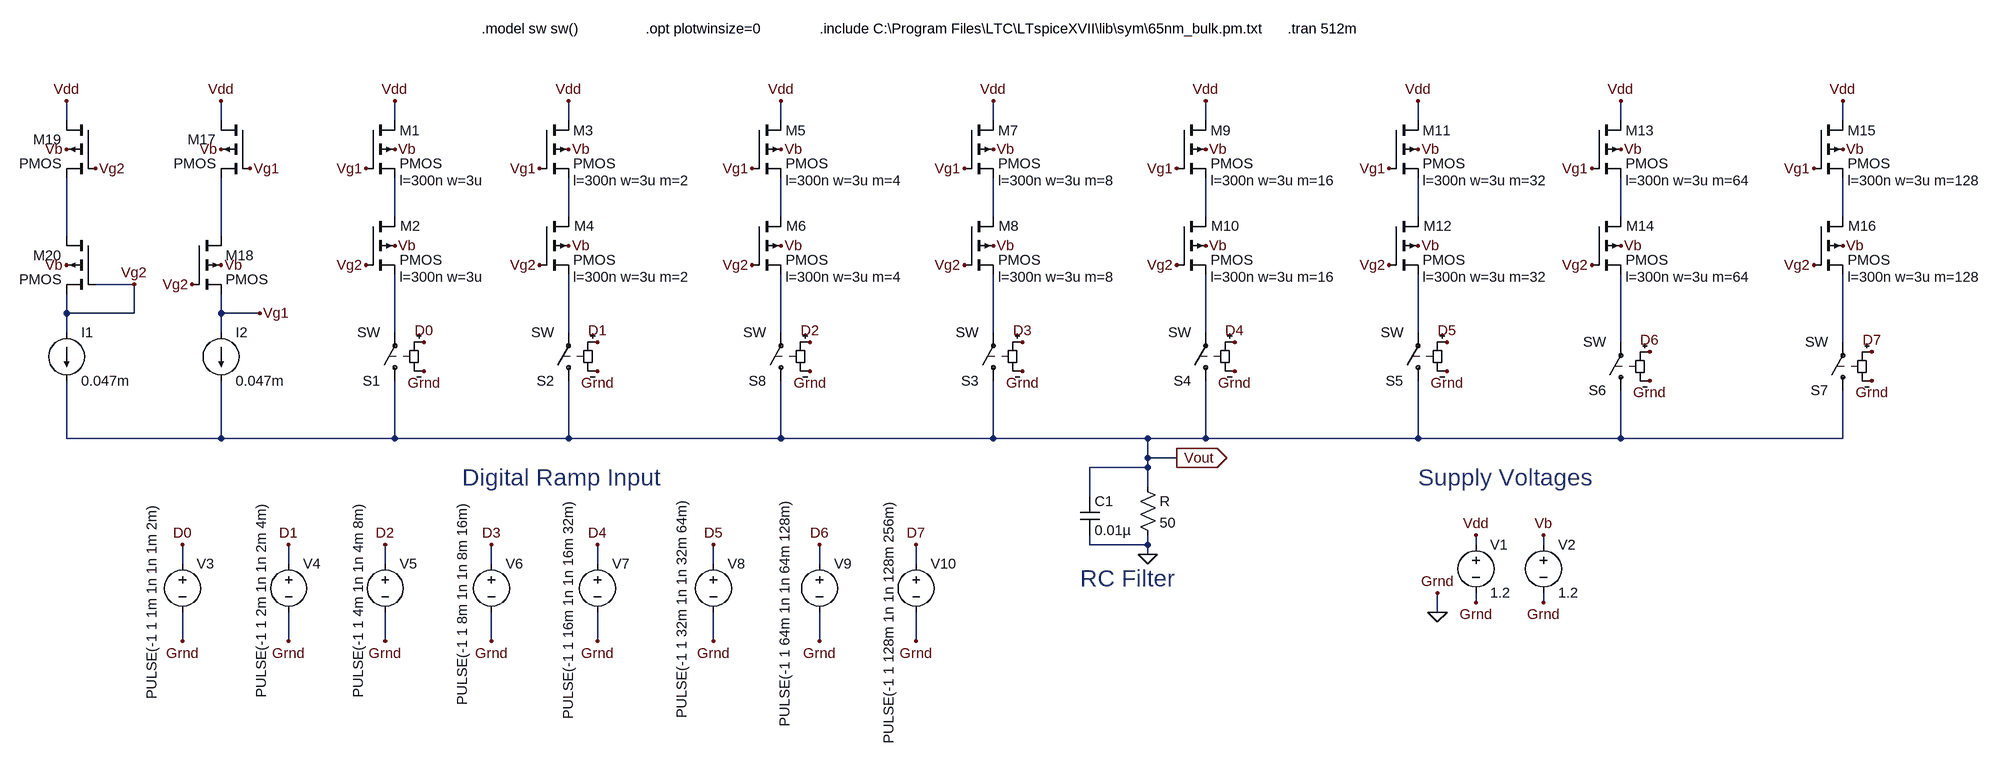
[diagram p0: schematic 8-bit-DAC-rampinput.asc]
8-bit-DAC-rampinput.asc, the LTspice schematic file:
Version 4
SHEET 1 3044 1416
WIRE -272 96 -272 64
WIRE -16 96 -16 64
WIRE 272 96 272 64
WIRE 560 96 560 64
WIRE 912 96 912 64
WIRE 1264 96 1264 64
WIRE 1616 96 1616 64
WIRE 1968 96 1968 64
WIRE 2304 96 2304 64
WIRE 2672 96 2672 64
WIRE 272 256 272 192
WIRE 560 256 560 192
WIRE 912 256 912 192
WIRE 1264 256 1264 192
WIRE 1616 256 1616 192
WIRE 1968 256 1968 192
WIRE 2304 256 2304 192
WIRE 2672 256 2672 192
WIRE -272 288 -272 192
WIRE -16 288 -16 192
WIRE -160 368 -224 368
WIRE -272 416 -272 384
WIRE -160 416 -160 368
WIRE -160 416 -272 416
WIRE -16 416 -16 384
WIRE 48 416 -16 416
WIRE -272 448 -272 416
WIRE -16 448 -16 416
WIRE 272 448 272 352
WIRE 560 448 560 352
WIRE 912 448 912 352
WIRE 1264 448 1264 352
WIRE 1616 448 1616 352
WIRE 1968 448 1968 352
WIRE 2304 464 2304 352
WIRE 2672 464 2672 352
WIRE -272 624 -272 528
WIRE -16 624 -16 528
WIRE -16 624 -272 624
WIRE 272 624 272 528
WIRE 272 624 -16 624
WIRE 560 624 560 528
WIRE 560 624 272 624
WIRE 912 624 912 528
WIRE 912 624 560 624
WIRE 1264 624 1264 528
WIRE 1264 624 912 624
WIRE 1520 624 1264 624
WIRE 1616 624 1616 528
WIRE 1616 624 1520 624
WIRE 1968 624 1968 528
WIRE 1968 624 1616 624
WIRE 2304 624 2304 544
WIRE 2304 624 1968 624
WIRE 2672 624 2672 544
WIRE 2672 624 2304 624
WIRE 1520 656 1520 624
WIRE 1568 656 1520 656
WIRE 1520 672 1520 656
WIRE 1520 672 1424 672
WIRE 1520 704 1520 672
WIRE 1424 720 1424 672
WIRE 1424 800 1424 784
WIRE 1520 800 1520 784
WIRE 1520 800 1424 800
WIRE 2064 800 2064 784
WIRE 2176 800 2176 784
WIRE 1520 816 1520 800
WIRE -80 832 -80 800
WIRE 96 832 96 800
WIRE 256 832 256 800
WIRE 432 832 432 800
WIRE 608 832 608 800
WIRE 800 832 800 800
WIRE 976 832 976 800
WIRE 1136 832 1136 800
WIRE 2064 896 2064 880
WIRE 2176 896 2176 880
WIRE 2000 912 2000 880
WIRE -80 960 -80 912
WIRE 96 960 96 912
WIRE 256 960 256 912
WIRE 432 960 432 912
WIRE 608 960 608 912
WIRE 800 960 800 912
WIRE 976 960 976 912
WIRE 1136 960 1136 912
FLAG -272 336 Vb
FLAG -16 336 Vb
FLAG -272 144 Vb
FLAG -16 144 Vb
FLAG -16 64 Vdd
FLAG -272 64 Vdd
FLAG -224 176 Vg2
FLAG -160 368 Vg2
FLAG 32 176 Vg1
FLAG 48 416 Vg1
FLAG 272 304 Vb
FLAG 272 144 Vb
FLAG 272 64 Vdd
FLAG 224 176 Vg1
FLAG 224 336 Vg2
FLAG -64 368 Vg2
FLAG 560 304 Vb
FLAG 560 144 Vb
FLAG 560 64 Vdd
FLAG 512 176 Vg1
FLAG 512 336 Vg2
FLAG 912 304 Vb
FLAG 912 144 Vb
FLAG 912 64 Vdd
FLAG 864 176 Vg1
FLAG 864 336 Vg2
FLAG 1264 304 Vb
FLAG 1264 144 Vb
FLAG 1264 64 Vdd
FLAG 1216 176 Vg1
FLAG 1216 336 Vg2
FLAG 1616 304 Vb
FLAG 1616 144 Vb
FLAG 1616 64 Vdd
FLAG 1568 176 Vg1
FLAG 1568 336 Vg2
FLAG 1968 304 Vb
FLAG 1968 144 Vb
FLAG 1968 64 Vdd
FLAG 1920 176 Vg1
FLAG 1920 336 Vg2
FLAG 2304 304 Vb
FLAG 2304 144 Vb
FLAG 2304 64 Vdd
FLAG 2256 176 Vg1
FLAG 2256 336 Vg2
FLAG 2672 304 Vb
FLAG 2672 144 Vb
FLAG 2672 64 Vdd
FLAG 2624 176 Vg1
FLAG 2624 336 Vg2
FLAG 2000 912 0
FLAG 2000 880 Grnd
FLAG 2064 896 Grnd
FLAG 2176 896 Grnd
FLAG 2176 784 Vb
FLAG 2064 784 Vdd
FLAG 96 960 Grnd
FLAG 256 960 Grnd
FLAG 432 960 Grnd
FLAG 608 960 Grnd
FLAG 800 960 Grnd
FLAG 976 960 Grnd
FLAG 1136 960 Grnd
FLAG -80 960 Grnd
FLAG -80 800 D0
FLAG 96 800 D1
FLAG 256 800 D2
FLAG 432 800 D3
FLAG 608 800 D4
FLAG 800 800 D5
FLAG 976 800 D6
FLAG 1136 800 D7
FLAG 320 512 Grnd
FLAG 608 512 Grnd
FLAG 960 512 Grnd
FLAG 1312 512 Grnd
FLAG 1664 512 Grnd
FLAG 2016 512 Grnd
FLAG 2352 528 Grnd
FLAG 2720 528 Grnd
FLAG 320 464 D0
FLAG 608 464 D1
FLAG 960 464 D2
FLAG 1312 464 D3
FLAG 1664 464 D4
FLAG 2016 464 D5
FLAG 2352 480 D6
FLAG 2720 480 D7
FLAG 1520 816 0
FLAG 1568 656 Vout
IOPIN 1568 656 Out
SYMBOL current -272 448 R0
WINDOW 123 0 0 Left 0
WINDOW 39 0 0 Left 0
SYMATTR InstName I1
SYMATTR Value 0.047m
SYMBOL current -16 448 R0
WINDOW 123 0 0 Left 0
WINDOW 39 0 0 Left 0
SYMATTR InstName I2
SYMATTR Value 0.047m
SYMBOL pmos4 224 96 R0
WINDOW 0 56 17 Left 2
WINDOW 123 56 100 Left 2
SYMATTR InstName M1
SYMATTR Value2 l=300n w=3u
SYMBOL pmos4 224 256 R0
WINDOW 0 57 15 Left 2
WINDOW 123 56 100 Left 2
SYMATTR InstName M2
SYMATTR Value2 l=300n w=3u
SYMBOL pmos4 512 96 R0
WINDOW 0 56 17 Left 2
WINDOW 123 56 100 Left 2
SYMATTR InstName M3
SYMATTR Value2 l=300n w=3u m=2
SYMBOL pmos4 512 256 R0
WINDOW 0 57 15 Left 2
WINDOW 123 56 100 Left 2
SYMATTR InstName M4
SYMATTR Value2 l=300n w=3u m=2
SYMBOL pmos4 864 96 R0
WINDOW 0 56 17 Left 2
WINDOW 123 56 100 Left 2
SYMATTR InstName M5
SYMATTR Value2 l=300n w=3u m=4
SYMBOL pmos4 864 256 R0
WINDOW 0 57 15 Left 2
WINDOW 123 56 100 Left 2
SYMATTR InstName M6
SYMATTR Value2 l=300n w=3u m=4
SYMBOL pmos4 1216 96 R0
WINDOW 0 56 17 Left 2
WINDOW 123 56 100 Left 2
SYMATTR InstName M7
SYMATTR Value2 l=300n w=3u m=8
SYMBOL pmos4 1216 256 R0
WINDOW 0 57 15 Left 2
WINDOW 123 56 100 Left 2
SYMATTR InstName M8
SYMATTR Value2 l=300n w=3u m=8
SYMBOL pmos4 1568 96 R0
WINDOW 0 56 17 Left 2
WINDOW 123 56 100 Left 2
SYMATTR InstName M9
SYMATTR Value2 l=300n w=3u m=16
SYMBOL pmos4 1568 256 R0
WINDOW 0 57 15 Left 2
WINDOW 123 56 100 Left 2
SYMATTR InstName M10
SYMATTR Value2 l=300n w=3u m=16
SYMBOL pmos4 1920 96 R0
WINDOW 0 56 17 Left 2
WINDOW 123 56 100 Left 2
SYMATTR InstName M11
SYMATTR Value2 l=300n w=3u m=32
SYMBOL pmos4 1920 256 R0
WINDOW 0 57 15 Left 2
WINDOW 123 56 100 Left 2
SYMATTR InstName M12
SYMATTR Value2 l=300n w=3u m=32
SYMBOL pmos4 2256 96 R0
WINDOW 0 56 17 Left 2
WINDOW 123 56 100 Left 2
SYMATTR InstName M13
SYMATTR Value2 l=300n w=3u m=64
SYMBOL pmos4 2256 256 R0
WINDOW 0 57 15 Left 2
WINDOW 123 56 100 Left 2
SYMATTR InstName M14
SYMATTR Value2 l=300n w=3u m=64
SYMBOL pmos4 2624 96 R0
WINDOW 0 56 17 Left 2
WINDOW 123 56 100 Left 2
SYMATTR InstName M15
SYMATTR Value2 l=300n w=3u m=128
SYMBOL pmos4 2624 256 R0
WINDOW 0 57 15 Left 2
WINDOW 123 56 100 Left 2
SYMATTR InstName M16
SYMATTR Value2 l=300n w=3u m=128
SYMBOL voltage 2064 784 R0
WINDOW 123 0 0 Left 0
WINDOW 39 0 0 Left 0
SYMATTR InstName V1
SYMATTR Value 1.2
SYMBOL voltage 2176 784 R0
WINDOW 123 0 0 Left 0
WINDOW 39 0 0 Left 0
SYMATTR InstName V2
SYMATTR Value 1.2
SYMBOL voltage -80 816 R0
WINDOW 3 -50 -85 VRight 2
WINDOW 123 0 0 Left 0
WINDOW 39 0 0 Left 0
SYMATTR Value PULSE(-1 1 1m 1n 1n 1m 2m)
SYMATTR InstName V3
SYMBOL voltage 96 816 R0
WINDOW 3 -45 -87 VRight 2
WINDOW 123 0 0 Left 0
WINDOW 39 0 0 Left 0
SYMATTR Value PULSE(-1 1 2m 1n 1n 2m 4m)
SYMATTR InstName V4
SYMBOL voltage 256 816 R0
WINDOW 3 -44 -87 VRight 2
WINDOW 123 0 0 Left 0
WINDOW 39 0 0 Left 0
SYMATTR Value PULSE(-1 1 4m 1n 1n 4m 8m)
SYMATTR InstName V5
SYMBOL voltage 432 816 R0
WINDOW 3 -48 -89 VRight 2
WINDOW 123 0 0 Left 0
WINDOW 39 0 0 Left 0
SYMATTR Value PULSE(-1 1 8m 1n 1n 8m 16m)
SYMATTR InstName V6
SYMBOL voltage 608 816 R0
WINDOW 3 -48 -92 VRight 2
WINDOW 123 0 0 Left 0
WINDOW 39 0 0 Left 0
SYMATTR Value PULSE(-1 1 16m 1n 1n 16m 32m)
SYMATTR InstName V7
SYMBOL voltage 800 816 R0
WINDOW 3 -52 -94 VRight 2
WINDOW 123 0 0 Left 0
WINDOW 39 0 0 Left 0
SYMATTR Value PULSE(-1 1 32m 1n 1n 32m 64m)
SYMATTR InstName V8
SYMBOL voltage 976 816 R0
WINDOW 3 -57 -93 VRight 2
WINDOW 123 0 0 Left 0
WINDOW 39 0 0 Left 0
SYMATTR Value PULSE(-1 1 64m 1n 1n 64m 128m)
SYMATTR InstName V9
SYMBOL voltage 1136 816 R0
WINDOW 3 -45 -92 VRight 2
WINDOW 123 0 0 Left 0
WINDOW 39 0 0 Left 0
SYMATTR Value PULSE(-1 1 128m 1n 1n 128m 256m)
SYMATTR InstName V10
SYMBOL sw 272 544 R180
SYMATTR InstName S1
SYMBOL sw 560 544 R180
SYMATTR InstName S2
SYMBOL sw 1264 544 R180
SYMATTR InstName S3
SYMBOL sw 1616 544 R180
SYMATTR InstName S4
SYMBOL sw 1968 544 R180
SYMATTR InstName S5
SYMBOL sw 2304 560 R180
SYMATTR InstName S6
SYMBOL sw 2672 560 R180
SYMATTR InstName S7
SYMBOL sw 912 544 R180
SYMATTR InstName S8
SYMBOL res 1504 688 R0
SYMATTR InstName R
SYMATTR Value 50
SYMBOL cap 1408 720 R0
SYMATTR InstName C1
SYMATTR Value 0.01µ
SYMBOL pmos4 32 96 M0
SYMATTR InstName M17
SYMATTR Value2 l=300n w=3u
SYMBOL pmos4 -64 288 R0
SYMATTR InstName M18
SYMATTR Value2 l=300n w=3u
SYMBOL pmos4 -224 96 M0
SYMATTR InstName M19
SYMATTR Value2 l=300n w=1u
SYMBOL pmos4 -224 288 M0
SYMATTR InstName M20
SYMATTR Value2 l=300n w=3u
TEXT 976 -56 Left 2 !.include C:\\Program Files\\LTC\\LTspiceXVII\\lib\\sym\\65nm_bulk.pm.txt
TEXT 688 -56 Left 2 !.opt plotwinsize=0
TEXT 416 -56 Left 2 !.model sw sw()
TEXT 1752 -56 Left 2 !.tran 512m
TEXT 384 688 Left 4 ;Digital Ramp Input
TEXT 1408 856 Left 4 ;RC Filter
TEXT 1968 688 Left 4 ;Supply Voltages

The netlist it stands for:
* 8-bit-DAC-rampinput.asc
I1 Vg2 Vout 0.047m
I2 Vg1 Vout 0.047m
M1 Vdd Vg1 N001 Vb PMOS l=300n w=3u
M2 N001 Vg2 N011 Vb PMOS l=300n w=3u
M3 Vdd Vg1 N002 Vb PMOS l=300n w=3u m=2
M4 N002 Vg2 N012 Vb PMOS l=300n w=3u m=2
M5 Vdd Vg1 N003 Vb PMOS l=300n w=3u m=4
M6 N003 Vg2 N013 Vb PMOS l=300n w=3u m=4
M7 Vdd Vg1 N004 Vb PMOS l=300n w=3u m=8
M8 N004 Vg2 N014 Vb PMOS l=300n w=3u m=8
M9 Vdd Vg1 N005 Vb PMOS l=300n w=3u m=16
M10 N005 Vg2 N015 Vb PMOS l=300n w=3u m=16
M11 Vdd Vg1 N006 Vb PMOS l=300n w=3u m=32
M12 N006 Vg2 N016 Vb PMOS l=300n w=3u m=32
M13 Vdd Vg1 N007 Vb PMOS l=300n w=3u m=64
M14 N007 Vg2 N017 Vb PMOS l=300n w=3u m=64
M15 Vdd Vg1 N008 Vb PMOS l=300n w=3u m=128
M16 N008 Vg2 N018 Vb PMOS l=300n w=3u m=128
V1 Vdd 0 1.2
V2 Vb 0 1.2
V3 D0 0 PULSE(-1 1 1m 1n 1n 1m 2m)
V4 D1 0 PULSE(-1 1 2m 1n 1n 2m 4m)
V5 D2 0 PULSE(-1 1 4m 1n 1n 4m 8m)
V6 D3 0 PULSE(-1 1 8m 1n 1n 8m 16m)
V7 D4 0 PULSE(-1 1 16m 1n 1n 16m 32m)
V8 D5 0 PULSE(-1 1 32m 1n 1n 32m 64m)
V9 D6 0 PULSE(-1 1 64m 1n 1n 64m 128m)
V10 D7 0 PULSE(-1 1 128m 1n 1n 128m 256m)
S1 Vout N011 D0 0 SW
S2 Vout N012 D1 0 SW
S3 Vout N014 D3 0 SW
S4 Vout N015 D4 0 SW
S5 Vout N016 D5 0 SW
S6 Vout N017 D6 0 SW
S7 Vout N018 D7 0 SW
S8 Vout N013 D2 0 SW
R Vout 0 50
C1 Vout 0 0.01µ
M17 Vdd Vg1 N010 Vb PMOS l=300n w=3u
M18 N010 Vg2 Vg1 Vb PMOS l=300n w=3u
M19 Vdd Vg2 N009 Vb PMOS l=300n w=1u
M20 N009 Vg2 Vg2 Vb PMOS l=300n w=3u
.model NMOS NMOS
.model PMOS PMOS
.lib standard.mos
.include C:\Program Files\LTC\LTspiceXVII\lib\sym\65nm_bulk.pm.txt
.opt plotwinsize=0
.model sw sw()
.tran 512m
* Digital Ramp Input
* RC Filter
* Supply Voltages
.backanno
.end